# EAGLE schematic AdvancedCircuit (EAGLE 9.6.2)
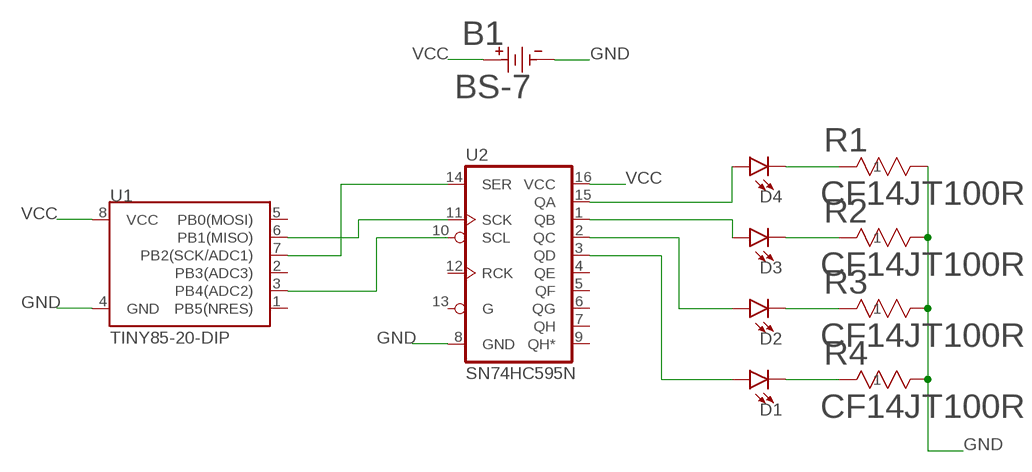
[diagram p0: schematic, sheet 1]

## Parts
B1  BS-7  [BS-7_MPD]
D1  LED3MM  [LED_3MM]
D2  LED3MM  [LED_3MM]
D3  LED3MM  [LED_3MM]
D4  LED3MM  [LED_3MM]
R1  CF14JT100R  [STA_CF14_STP]
R2  CF14JT100R  [STA_CF14_STP]
R3  CF14JT100R  [STA_CF14_STP]
R4  CF14JT100R  [STA_CF14_STP]
U1  TINY85-20-DIP  ATTINY45TINY85-20-DIP  [DIP08_MCU]
U2  SN74HC595N  74HC595N  [DIP16]

## Nets
GND: B1.1 R1.2 R2.2 R3.2 R4.2 U1.4(GND) U2.8(GND)
N$1: U1.3(PB4(ADC2)) U2.10(SCL)
N$2: U1.6(PB1(MISO)) U2.11(SCK)
N$3: U1.7(PB2(SCK/ADC1)) U2.14(SER)
N$4: D4.A U2.15(QA)
N$5: D3.A U2.1(QB)
N$6: D2.A U2.2(QC)
N$7: D1.A U2.3(QD)
N$8: D4.K(C) R1.1
N$9: D3.K(C) R2.1
N$10: D2.K(C) R3.1
N$11: D1.K(C) R4.1
VCC: B1.2 U1.8(VCC) U2.16(VCC)
Unconnected: U1.1(PB5(NRES)) U1.2(PB3(ADC3)) U1.5(PB0(MOSI)) U2.4(QE) U2.5(QF) U2.6(QG) U2.7(QH) U2.9(QH*) U2.12(RCK) U2.13(G)

## Library data of the parts
B1 = BS-7:BS-7; BUILT_BY: EMA_Cory; COPYRIGHT: Copyright (C) 2018 Accelerated Designs. All rights reserved; DATASHEET: http://www.memoryprotectiondevices.com/datasheets/BS-7-datasheet.pdf; MANUFACTURER_PART_NUMBER: BS-7; SOURCELIBRARY: Memory_Protection_Devices_2020-03-04; VENDOR: Memory Protection Devices, Inc
D1-D4 = SparkFun-LED:LED: LED (Generic) Standard schematic elements and footprints for 5mm, 3mm, 1206, and 0603 sized LEDs. Generic LEDs with no color specified.; PROD_ID: DIO-08794
R1-R4 = 100Resistor:CF14JT100R; BUILT_BY: EMA_UL_Team; MANUFACTURER_PART_NUMBER: CF14JT100R; SOURCELIBRARY: Stackpole_2014-12-31; VENDOR: Stackpole International
U1 = SparkFun-Retired:ATTINY45: Atmel 8-pin 2/4/8kB flash uC Retired; PROD_ID: IC-09445
U2 = SparkFun-IC-Logic:74*595: 8-Bit Shift Register (Serial to Parallel) Datasheet <http://cdn.sparkfun.com/datasheets/BreakoutBoards/MM74HC595.pdf> SparkFun Products SparkFun Shift Register Breakout - 74HC595 <https://www.sparkfun.com/products/10680> (BOB-10680); PROD_ID: IC-13123